# Altium schematic sheet 01-M2_NEO-M9N_MODULE.SchDoc: NOT USED
size A4; ApprovedBy: NOT USED; CheckedBy: NOT USED; Author: NOT USED; CompanyName: NOT USED; DrawnBy: NOT USED; Engineer: NOT USED; Organization: NOT USED; Address1: NOT USED; Address2: NOT USED; Address3: NOT USED; Address4: NOT USED; Revision: NOT USED; SheetNumber: 1; SheetTotal: 2; sch_PageDescription: sch_PageDescription; sch_PageTitle: sch_PageTitle; DocumentFullPathAndName: NOT USED; DocumentName: NOT USED; ImagePath: NOT USED; ProjectName: NOT USED; Application_BuildNumber: NOT USED
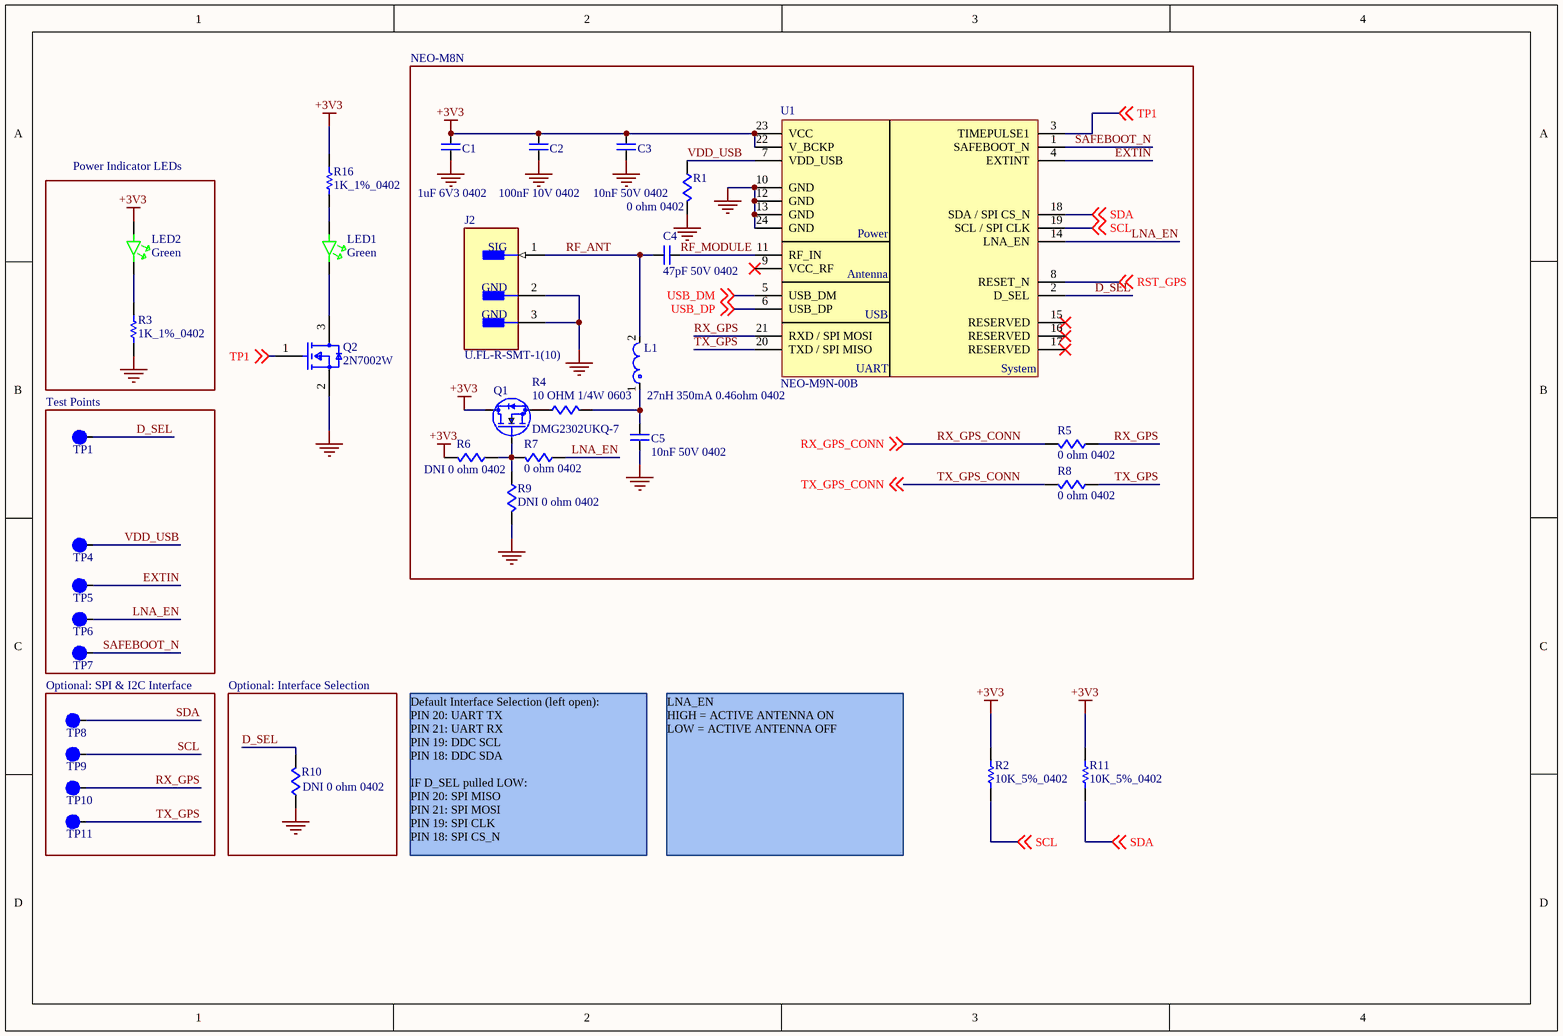
[diagram p0: 01-M2_NEO-M9N_MODULE.SchDoc]

## Parts
C1  1uF 6V3 0402  [c0402]
C2  100nF 10V 0402  [c0402]
C3  10nF 50V 0402  [c0402]
C4  47pF 50V 0402  [c0402]
C5  10nF 50V 0402  [c0402]
J2  U.FL-R-SMT-1(10)  [FP-U_FL-R-SMT-1_10-MFG]
L1  27nH 350mA 0.46ohm 0402  [FP-LQG15HH_02-IPC_C]
LED1  Green  [led0603]
LED2  Green  [led0603]
Q1  DMG2302UKQ-7  [SOT23]
Q2  2N7002W  [FP-419AB-01-IPC_C]
R1  0 ohm 0402  [r0402]
R2  10K_5%_0402  [RESC1005X40X25LL05T10]
R3  1K_1%_0402  [RESC1005X40X25NL05T05]
R4  10 OHM 1/4W 0603  [r0603]
R5  0 ohm 0402  [r0402]
R6  DNI 0 ohm 0402  [r0402]  (no BOM)
R7  0 ohm 0402  [r0402]
R8  0 ohm 0402  [r0402]
R9  DNI 0 ohm 0402  [r0402]  (no BOM)
R10  DNI 0 ohm 0402  [r0402]  (no BOM)
R11  10K_5%_0402  [RESC1005X40X25LL05T10]
R16  1K_1%_0402  [RESC1005X40X25NL05T05]
TP1  1MM  [TP1MM]  (value not drawn)  (no BOM)
TP4  1MM  [TP1MM]  (value not drawn)  (no BOM)
TP5  1MM  [TP1MM]  (value not drawn)  (no BOM)
TP6  1MM  [TP1MM]  (value not drawn)  (no BOM)
TP7  1MM  [TP1MM]  (value not drawn)  (no BOM)
TP8  1MM  [TP1MM]  (value not drawn)  (no BOM)
TP9  1MM  [TP1MM]  (value not drawn)  (no BOM)
TP10  1MM  [TP1MM]  (value not drawn)  (no BOM)
TP11  1MM  [TP1MM]  (value not drawn)  (no BOM)
U1  NEO-M9N-00B  [IC_NEO-M9N]

## Blocks framed on the sheet
NEO-M8N: C1-C5 J2 L1 Q1 R1 R4-R9 U1
Power Indicator LEDs: LED2 R3
Test Points: TP1 TP4-TP7
Optional: SPI & I2C Interface: TP8-TP11
Optional: Interface Selection: R10

## Nets
+3V3: C1.2 C2.2 C3.2 LED2.1 Q1.2(D) R2.2 R6.2 R11.2 R16.2 U1.22(V_BCKP) U1.23(VCC)
GND: C1.1 C2.1 C3.1 C5.1 J2.2(GND) J2.3(GND) Q2.2(Source) R1.2 R3.1 R9.2 R10.1 U1.10(GND) U1.12(GND) U1.13(GND) U1.24(GND)
D_SEL: R10.2 TP1.1 U1.2(D_SEL)
EXTIN: TP5.1 U1.4(EXTINT)
LNA_EN: R7.1 TP6.1 U1.14(LNA_EN)
RF_ANT: C4.1 J2.1(SIG) L1.2
RF_MODULE: C4.2 U1.11(RF_IN)
RST_GPS: U1.8(RESET_N) ; off-sheet RST_GPS
RX_GPS: R5.1 TP10.1 U1.21(RXD_/_SPI_MOSI)
RX_GPS_CONN: R5.2 ; off-sheet RX_GPS_CONN
SAFEBOOT_N: TP7.1 U1.1(SAFEBOOT_N)
SCL: R2.1 TP9.1 U1.19(SCL_/_SPI_CLK) ; off-sheet SCL
SDA: R11.1 TP8.1 U1.18(SDA_/_SPI_CS_N) ; off-sheet SDA
TP1: Q2.1(Gate) U1.3(TIMEPULSE1) ; off-sheet TP1
TX_GPS: R8.1 TP11.1 U1.20(TXD_/_SPI_MISO)
TX_GPS_CONN: R8.2 ; off-sheet TX_GPS_CONN
USB_DM: U1.5(USB_DM) ; off-sheet USB_DM
USB_DP: U1.6(USB_DP) ; off-sheet USB_DP
VDD_USB: R1.1 TP4.1 U1.7(VDD_USB)
NetC5_2: C5.2 L1.1 R4.2
NetLED1_1: LED1.1 R16.1
NetLED1_2: LED1.2 Q2.3(Drain)
NetLED2_2: LED2.2 R3.2
NetQ1_1: Q1.1(G) R6.1 R7.2 R9.1
NetQ1_3: Q1.3(S) R4.1

Not connected (* = marked no-connect by the designer): U1 9(VCC_RF)* 15(RESERVED)* 16(RESERVED)* 17(RESERVED)*

## Notes on the sheet
- Default Interface Selection (left open):
  PIN 20: UART TX
  PIN 21: UART RX
  PIN 19: DDC SCL
  PIN 18: DDC SDA
  IF D_SEL pulled LOW:
  PIN 20: SPI MISO
  PIN 21: SPI MOSI
  PIN 19: SPI CLK
  PIN 18: SPI CS_N
- LNA_EN
  HIGH = ACTIVE ANTENNA ON
  LOW = ACTIVE ANTENNA OFF
- CONFIDENTIALITY NOTICE
- TITLE
- PROJECT
- ENGINEER
- FILENAME
- GENERATED DATE
- DESCRIPTION
- SCHEMATIC NUMBER
- REV
- SHEET
- THIS DOCUMENT IS CONFIDENTIAL AND CONTAINS DESIGNS AND OTHER PROPRIETARY INFORMATION OF META PLATFORMS TECHNOLOGIES, LLC AND ITS AFFILIATES. THIS DOCUMENT AND THE INFORMATION IT CONTAINS MAY NOT BE DUPLICATED, DISCLOSED OR USED, IN WHOLE OR IN PART, FOR ANY PURPOSE (INCLUDING MANUFACTURE OF ANY COMPONENT) WITHOUT THE PRIOR WRITTEN CONSENT OF META PLATFORMS TECHNOLOGIES, LLC.
- (in symbol IC NEO-M9N-00B) Power; Antenna; USB; UART; System

## Library data of the parts
C1 = CAP CER 1UF 6.3V X7R 0402: 0402 1 uF 6.3 V ±10% Tolerance X7R Multilayer Ceramic Capacitor; Manufacturer: Murata; Manufacturer Part Number: GRM155R70J105KA12J; Voltage Rating: 6.3V; Supplier 1: Digi-Key; RoHS: Yes; Category: Ceramic Capacitors; Stock 1: 7275801; Pricing 1: 1=0.10000, 10=0.07300, 50=0.04000, 100=0.03270, 500=0.02334, 1000=0.01833, 2500=0.01666, 5000=0.01533 (USD); Mount: Surface Mount; Case/Package: 0402; Case Code (Metric): 1005; Case Code (Imperial): 0402; Weight: 0.000212oz; Min Operating Temperature: -55°C; Max Operating Temperature: 125°C; Packaging: Tape and Reel; Capacitance: 1uF; Tolerance: 10%; Dielectric: X7R; Termination: SMD/SMT; Voltage Rating (DC): 6.3V; Package Quantity: 50000; Length: 0.039inch; Width: 0.02inch; Thickness: 0.022inch; RoHS Compliant: Yes; ComponentLink1URL: http://www.mouser.com/ds/2/281/c02e-2905.pdf?src-supplier=Mouser; ComponentLink1Description: http://www.mouser.com/ds/2/281/c02e-2905.pdf?src-supplier=Mouser; ComponentLink2URL: http://search.murata.co.jp/Ceramy/image/img/A01X/G101/ENG/GRM155R70J105KA12-01.pdf?src-supplier=Digi-Key; ComponentLink2Description: http://search.murata.co.jp/Ceramy/image/img/A01X/G101/ENG/GRM155R70J105KA12-01.pdf?src-supplier=Digi-Key; Supplier Part Number 1: 490-13339-1-ND
C2 = CAP CER 0.1UF 10V X7R 0402: CL05 Series 0.1 uF 10 V ±10 % Tolerance X7R SMT Multilayer Ceramic Capacitor; Manufacturer: Samsung; Manufacturer Part Number: CL05B104KP5NNNC; Tolerance: 10%; Supplier 1: Digi-Key; RoHS: Yes; Category: Ceramic Capacitors; Stock 1: 36338332; Pricing 1: 1=0.10000, 10=0.02400, 50=0.01300, 100=0.01050, 500=0.00752, 1000=0.00592, 2500=0.00538, 5000=0.00495 (USD); Mount: Surface Mount; Case/Package: 0402; Case Code (Metric): 1005; Case Code (Imperial): 0402; Contact Plating: Tin; Min Operating Temperature: -55°C; Max Operating Temperature: 125°C; Package Quantity: 1; Packaging: Tape and Reel; Capacitance: 100nF; Voltage Rating: 10V; Dielectric: X7R; Series: CL; Construction: Flat; Length: 1mm; Width: 0.02inch; Height: 0.5mm; Thickness: 0.022inch; Depth: 0.5mm; Radiation Hardening: No; RoHS Compliant: Yes; ComponentLink1URL: https://datasheet.ciiva.com/15165/getdatasheetpartid-37100-15165107.pdf?src-supplier=Verical; ComponentLink1Description: https://datasheet.ciiva.com/15165/getdatasheetpartid-37100-15165107.pdf?src-supplier=Verical; ComponentLink2URL: https://datasheet.ciiva.com/16498/cl05b104kq5nnnc-16498491.pdf?src-supplier=Future+Electronics; ComponentLink2Description: https://datasheet.ciiva.com/16498/cl05b104kq5nnnc-16498491.pdf?src-supplier=Future+Electronics; Supplier Part Number 1: 1276-1002-1-ND
C3 C5 = CAP CER 10000PF 50V X7R 0402: Manufacturer: Murata; Manufacturer Part Number: GCM155R71H103KA55D; Tolerance: 10%; Supplier 1: Digi-Key; RoHS: Yes; Category: Ceramic Capacitors; Stock 1: 16109194; Pricing 1: 1=0.10000, 10=0.02700, 50=0.01460, 100=0.01190, 500=0.00848, 1000=0.00667, 2500=0.00606, 5000=0.00558 (USD); Mount: Surface Mount; Case/Package: 0402; Case Code (Imperial): 0402; Case Code (Metric): 1005; Min Operating Temperature: -55°C; Max Operating Temperature: 125°C; Capacitance: 10nF; Voltage Rating: 50V; Packaging: Tape and Reel; Package Quantity: 1; Dielectric: X7R; Termination: SMD/SMT; Voltage: 50V; Voltage Rating (DC): 50V; Series: GCM; Construction: Flat; Length: 1mm; Width: 0.02inch; Height: 0.5mm; Thickness: 0.022inch; Depth: 0.5mm; Ratings: AEC-Q200; Radiation Hardening: No; REACH SVHC: No SVHC; Lead Free: Lead Free; RoHS Compliant: Yes; ComponentLink1URL: https://datasheet.ciiva.com/130/product-130683.pdf?src-supplier=Digi-Key; ComponentLink1Description: https://datasheet.ciiva.com/130/product-130683.pdf?src-supplier=Digi-Key; ComponentLink2URL: https://datasheet.ciiva.com/130/product-130682.pdf?src-supplier=Digi-Key; ComponentLink2Description: https://datasheet.ciiva.com/130/product-130682.pdf?src-supplier=Digi-Key; ComponentLink3URL: https://datasheet.ciiva.com/130/product-130684.pdf?src-supplier=Digi-Key; ComponentLink3Description: https://datasheet.ciiva.com/130/product-130684.pdf?src-supplier=Digi-Key; ComponentLink4URL: https://datasheet.ciiva.com/11787/0900766b80ef92d0-11787082.pdf?src-supplier=RSComponents; ComponentLink4Description: https://datasheet.ciiva.com/11787/0900766b80ef92d0-11787082.pdf?src-supplier=RSComponents; ComponentLink5URL: https://datasheet.ciiva.com/16199/product-16199584.pdf?src-supplier=Future+Electronics; ComponentLink5Description: https://datasheet.ciiva.com/16199/product-16199584.pdf?src-supplier=Future+Electronics; ComponentLink6URL: https://datasheet.ciiva.com/18100/getdatasheetpartid-27433-18100656.pdf?src-supplier=Verical; ComponentLink6Description: https://datasheet.ciiva.com/18100/getdatasheetpartid-27433-18100656.pdf?src-supplier=Verical; ComponentLink7URL: https://datasheet.ciiva.com/2989/product-2989235.pdf?src-supplier=Avnet; ComponentLink7Description: https://datasheet.ciiva.com/2989/product-2989235.pdf?src-supplier=Avnet; Supplier Part Number 1: 490-4762-1-ND
C4 = CAP CER 47PF 50V C0G/NPO 0402: 0402 47 pF 50 V ±5 % Tolerance NP0 SMT Multilayer Ceramic Capacitor; Manufacturer: Yageo; Manufacturer Part Number: CC0402JRNPO9BN470; Tolerance: 5%; Dielectric: C0G; Insulation Resistance: 100GR; Supplier 1: Digi-Key; RoHS: Yes; Category: Ceramic Capacitors; Stock 1: 4278982; Pricing 1: 1=0.10000, 10=0.01800, 50=0.01000, 100=0.00820, 500=0.00584, 1000=0.00458, 2500=0.00417, 5000=0.00383 (USD); Mount: Surface Mount; Case/Package: 0402; Number of Pins: 2; Case Code (Metric): 1005; Case Code (Imperial): 0402; Weight: 2.3E-05oz; Dielectric Material: Ceramic; Min Operating Temperature: -55°C; Max Operating Temperature: 125°C; Capacitance: 47pF; Voltage Rating: 50V; Package Quantity: 1; Packaging: Tape and Reel; Voltage Rating (DC): 50V; Termination: SMD/SMT; Resistor Type: Ceramic; Voltage: 50V; Series: CC; Length: 1mm; Width: 0.02inch; Height: 0.5mm; Thickness: 0.022inch; Depth: 0.5mm; Radiation Hardening: No; REACH SVHC: No SVHC; Lead Free: Lead Free; RoHS Compliant: Yes; ComponentLink1URL: https://datasheet.ciiva.com/28450/1443161-28450267.pdf?src-supplier=Element14; ComponentLink1Description: https://datasheet.ciiva.com/28450/1443161-28450267.pdf?src-supplier=Element14; ComponentLink2URL: https://datasheet.ciiva.com/8033/1443161-8033638.pdf?src-supplier=Element14; ComponentLink2Description: https://datasheet.ciiva.com/8033/1443161-8033638.pdf?src-supplier=Element14; ComponentLink3URL: https://datasheet.ciiva.com/8033/1443161-8033637.pdf?src-supplier=Element14; ComponentLink3Description: https://datasheet.ciiva.com/8033/1443161-8033637.pdf?src-supplier=Element14; ComponentLink4URL: https://datasheet.ciiva.com/161/mlccorderingcode-161493.pdf?src-supplier=Digi-Key; ComponentLink4Description: https://datasheet.ciiva.com/161/mlccorderingcode-161493.pdf?src-supplier=Digi-Key; ComponentLink5URL: https://datasheet.ciiva.com/161/mlccorderingcode-161492.pdf?src-supplier=Digi-Key; ComponentLink5Description: https://datasheet.ciiva.com/161/mlccorderingcode-161492.pdf?src-supplier=Digi-Key; ComponentLink6URL: https://datasheet.ciiva.com/161/mlccorderingcode-161494.pdf?src-supplier=Digi-Key; ComponentLink6Description: https://datasheet.ciiva.com/161/mlccorderingcode-161494.pdf?src-supplier=Digi-Key; Supplier Part Number 1: 311-1021-1-ND
J2 = CMP-2000-05152-3: CONN U.FL RCPT STR 50 OHM SMD; Max Frequency: 6GHz; Connector Type: Coaxial; Body Plating: Silver; Body Material: Bronze; Impedance: 50R; Dielectric Material: Polymer; Insulation Resistance: 500MR; Gender: Male; Packaging: Cut Tape; Length: 3mm; Package Quantity: 2500; Termination: Solder; Lead Free: Lead Free; Series: U.FL; Min Operating Temperature: -40°C; Fastening Type: Snap; Contact Material: Brass; Orientation: Straight; Wire/Cable Type: Coaxial; Frequency: 6GHz; Contact Plating: Gold; Depth: 3.1mm; Weight: 0.001764oz; Max Operating Temperature: 90°C; Radiation Hardening: No; REACH SVHC: No SVHC; Mount: Surface Mount; Housing Color: Beige
L1 = CMP-2000-06578-2: Multilayer type RF Inductor 27nH ±5% 0.46Ω 350mA 0402; Manufacturer Part Number: LQG15HS27NJ02D; DC Current: 300mA; Core Material: Air; Self Resonant Frequency: 1.7GHz; Q Factor: 8; DC Resistance (DCR): 460mR; Shielding: Unshielded; Test Frequency: 100MHz; Inductance: 27nH; Width: 0.02inch; Length: 1mm; Height - Seated (Max): 0.022inch; Military Standard: Not; Case Code (Imperial): 0402; Tolerance: 5%; Depth: 0.55mm; Current Rating: 300mA; Inductance Tolerance: 5%; Lead Free: Lead Free; Height: 0.5mm; Max DC Current: 300mA; REACH SVHC: No SVHC; Package Quantity: 10000; Mount: Surface Mount; Termination: SMD/SMT; Case Code (Metric): 1005; Case/Package: 0402; Max Operating Temperature: 125°C; Packaging: Tape and Reel; Min Operating Temperature: -55°C
LED1 LED2 = LED GREEN CLEAR CHIP SMD: LED High-Power Uni-Color Green 574nm 2-Pin Chip LED T/R; Manufacturer: Vishay Lite-On; Manufacturer Part Number: LTST-C190KGKT; Lens Color: Colorless; Lens Style: Diffused,Colorless,Rectangular,Clear; Forward Voltage: 2V; Forward Current: 30mA; Luminous Intensity: 35mcd; Viewing Angle: 130°; Power Rating: 75mW; Dominant Wavelength: 571nm; Test Current: 20mA; Lens Transparency: Clear; Number of Elements: 1; Reverse Voltage: 5V; Supplier 1: Digi-Key; RoHS: Yes; Category: LEDs; Stock 1: 1803324; Pricing 1: 1=0.24000, 10=0.13200, 100=0.06110, 500=0.05640, 1000=0.04418, 2000=0.04324 (USD); Mount: Surface Mount; Case/Package: 0603; Number of Pins: 2; Color: Green; Case Code (Metric): 1608; Case Code (Imperial): 0603; Min Operating Temperature: -55°C; Max Operating Temperature: 85°C; Package Quantity: 1; Packaging: Tape and Reel; Illumination Color: Green; Power Dissipation: 75mW; Wavelength: 574nm; Number of LEDs: 1; Length: 1.6mm; Width: 0.8mm; Height: 0.8mm; Depth: 0.8mm; Radiation Hardening: No; Lead Free: Lead Free; RoHS Compliant: Yes; ComponentLink1URL: https://datasheet.ciiva.com/11774/0900766b80dc02a8-11774060.pdf?src-supplier=RSComponents; ComponentLink1Description: https://datasheet.ciiva.com/11774/0900766b80dc02a8-11774060.pdf?src-supplier=RSComponents; ComponentLink2URL: https://datasheet.ciiva.com/12403/100-ltst-c190kgkt-63268-12403899.pdf?src-supplier=Mouser; ComponentLink2Description: https://datasheet.ciiva.com/12403/100-ltst-c190kgkt-63268-12403899.pdf?src-supplier=Mouser; ComponentLink3URL: https://datasheet.ciiva.com/15117/getdatasheetpartid-141494-15117731.pdf?src-supplier=Verical; ComponentLink3Description: https://datasheet.ciiva.com/15117/getdatasheetpartid-141494-15117731.pdf?src-supplier=Verical; ComponentLink4URL: https://datasheet.ciiva.com/2109/s-110-ltst-c190kgkt-2109989.pdf?src-supplier=Digi-Key; ComponentLink4Description: https://datasheet.ciiva.com/2109/s-110-ltst-c190kgkt-2109989.pdf?src-supplier=Digi-Key; ComponentLink5URL: https://datasheet.ciiva.com/2109/s-110-ltst-c190kgkt-2109988.pdf?src-supplier=Digi-Key; ComponentLink5Description: https://datasheet.ciiva.com/2109/s-110-ltst-c190kgkt-2109988.pdf?src-supplier=Digi-Key; ComponentLink6URL: https://datasheet.ciiva.com/2109/s-110-ltst-c190kgkt-2109990.pdf?src-supplier=Digi-Key; ComponentLink6Description: https://datasheet.ciiva.com/2109/s-110-ltst-c190kgkt-2109990.pdf?src-supplier=Digi-Key; Supplier Part Number 1: 160-1435-1-ND
Q1 = DMG2302UKQ-7: N-Channel 20 V 2.8A (Ta) 660mW (Ta) Surface Mount SOT-23-3; Mfr_Name: Diodes Inc; Manufacturer: Diodes; Type: DEV; Drain to Source Voltage (Vdss): 20V; Rds On Max: 90mR; Input Capacitance: 130pF; Copyright: Copyright (C) 2022 Ultra Librarian. All rights reserved.; Manufacturer_Part_Number: DMG2302UKQ-7; Digi-Key_Part_Number_1: 31-DMG2302UKQ-7TR-ND; Digi-Key_Part_Number_2: 31-DMG2302UKQ-7CT-ND; Digi-Key_Part_Number_3: 31-DMG2302UKQ-7DKR-ND; RefDes: RefDes; Supplier 1: Digi-Key; Manufacturer Part Number: DMG2302UKQ-7; RoHS: Yes; Stock 1: 997695; Pricing 1: 1=0.48000, 10=0.36000, 100=0.22400, 500=0.15330, 1000=0.11792 (USD); Mount: Surface Mount; Case/Package: SOT-23; Min Operating Temperature: -55°C; Max Operating Temperature: 150°C; Packaging: Tape and Reel; Continuous Drain Current (ID): 2.8A; Max Power Dissipation: 660mW; Supplier Part Number 1: 31-DMG2302UKQ-7CT-ND
Q2 = CMP-07173-000098-1: MOSFET N-CH 60V 115MA SOT-323; Turn-On Delay Time: 5.85ns; Number of Elements: 1; Max Power Dissipation: 200mW; On-State Resistance: 7.5R; Element Configuration: Single; Gate to Source Voltage (Vgs): 20V; Input Capacitance: 50pF; Threshold Voltage: 1.76V; Turn-Off Delay Time: 12.5ns; Height: 1mm; Contact Plating: Tin; Package Quantity: 1; Continuous Drain Current (ID): 115mA; Case/Package: SOT-323; Lead Free: Lead Free; REACH SVHC: No SVHC; Packaging: Tape and Reel; Min Operating Temperature: -55°C; Weight: 0.03g; Drain to Source Voltage (Vdss): 60V; Width: 1.25mm; Mount: Surface Mount; Rds On Max: 7.5R; Drain to Source Resistance: 7.5R; Max Operating Temperature: 150°C; Radiation Hardening: No; Number of Pins: 3; Power Dissipation: 200mW; Drain to Source Breakdown Voltage: 60V; Length: 2mm
R1 R5-R10 = RES 0 OHM JUMPER 1/16W 0402: RES SMD 0 OHM JUMPER 1/16W 0402; Manufacturer: Yageo; Manufacturer Part Number: RC0402JR-070RL; Resistance: 0mR; Power Rating: 62.5mW; Tolerance: 5%; Voltage Rating: 50V; Max Power Dissipation: 63mW; Temperature Coefficient: 200ppm/°C; Supplier 1: Digi-Key; RoHS: Yes; Category: Chip SMD Resistors; Stock 1: 45165868; Pricing 1: 1=0.10000, 10=0.01200, 25=0.00840, 50=0.00640, 100=0.00480, 250=0.00364, 500=0.00290, 1000=0.00214, 5000=0.00154 (USD); Case/Package: 0402; Case Code (Metric): 1005; Case Code (Imperial): 0402; Contact Plating: Tin,Matte; Size Code: 0402; Min Operating Temperature: -55°C; Max Operating Temperature: 155°C; Package Quantity: 1; Packaging: Tape and Reel; Resistor Type: Thick Film; Number of Terminations: 2; Termination: SMD/SMT; Features: Moisture Resistant; Series: RC; Technology: THICK FILM; Resistance Tolerance: 5%; Construction: Rectangular; Length: 1mm; Width: 0.02inch; Height: 0.016inch; Depth: 0.5mm; Radiation Hardening: No; REACH SVHC: Unknown; Military Standard: Not; Lead Free: Lead Free; RoHS Compliant: Yes; ComponentLink1URL: https://datasheet.ciiva.com/2452/pyu-rc0402-51-rohs-l-6-2452608.pdf?src-supplier=Digi-Key; ComponentLink1Description: https://datasheet.ciiva.com/2452/pyu-rc0402-51-rohs-l-6-2452608.pdf?src-supplier=Digi-Key; ComponentLink2URL: https://datasheet.ciiva.com/11808/0900766b80c66297-11808195.pdf?src-supplier=RSComponents; ComponentLink2Description: https://datasheet.ciiva.com/11808/0900766b80c66297-11808195.pdf?src-supplier=RSComponents; ComponentLink3URL: https://datasheet.ciiva.com/7983/1018594-7983535.pdf?src-supplier=Element14; ComponentLink3Description: https://datasheet.ciiva.com/7983/1018594-7983535.pdf?src-supplier=Element14; ComponentLink4URL: https://datasheet.ciiva.com/22747/1018594-22747515.pdf?src-supplier=Element14; ComponentLink4Description: https://datasheet.ciiva.com/22747/1018594-22747515.pdf?src-supplier=Element14; ComponentLink5URL: https://datasheet.ciiva.com/2452/pyu-r-int-thick-7-2452609.pdf?src-supplier=Digi-Key; ComponentLink5Description: https://datasheet.ciiva.com/2452/pyu-r-int-thick-7-2452609.pdf?src-supplier=Digi-Key; ComponentLink6URL: https://datasheet.ciiva.com/2452/pyu-r-int-thick-7-2452610.pdf?src-supplier=Digi-Key; ComponentLink6Description: https://datasheet.ciiva.com/2452/pyu-r-int-thick-7-2452610.pdf?src-supplier=Digi-Key; ComponentLink7URL: https://datasheet.ciiva.com/8896/pyu-rc0402-51-rohs-l-6-8896201.pdf?src-supplier=Avnet; ComponentLink7Description: https://datasheet.ciiva.com/8896/pyu-rc0402-51-rohs-l-6-8896201.pdf?src-supplier=Avnet; ComponentLink8URL: https://datasheet.ciiva.com/15189/getdatasheetpartid-326379-15189533.pdf?src-supplier=Verical; ComponentLink8Description: https://datasheet.ciiva.com/15189/getdatasheetpartid-326379-15189533.pdf?src-supplier=Verical; Supplier Part Number 1: 311-0.0JRCT-ND
R2 R11 = CMP-2002-07353-1: Part Number: RC0402FR-0710KL; Manufacturer: Yageo / Phycomp
R3 R16 = CMP-1011-00510-4: Chip Resistor, 1 KOhm, +/- 1%, 100 mW, -55 to 155 degC, 0402 (1005 Metric), RoHS, Tape and Reel; PartNumber: ERJ-2RKF1001X; Manufacturer: Basic Passives; Voltage Rating: 50 V; Case\/Package: 0402; Resistance: 1 KOhm; Power Rating: 100 mW; DatasheetVersion: 04/2015; Radiation Hardening: No; Pins: 2; Height: 0.35 mm; RoHSCompliant: true; Case Code (Imperial): 0402; ComponentLink2Description: Datasheet; ComponentLink1Description: Manufacturer URL; PackageReference: 0402; Mount: Surface Mount; Package Quantity: 10000; Tolerance: 1%; ComponentLink1URL: http://www.panasonic.com/; PackageDescription: 2-Pin Surface Mount Device, Body 1 x 0.5 mm; Mounting Technology: Surface Mount; Case Code (Metric): 1005; ComponentLink2URL: http://industrial.panasonic.com/cdbs/www-data/pdf/RDA0000/AOA0000C86.pdf; REACH SVHC: Yes; Packaging: Tape and Reel; Max Operating Temperature: 155 degC; Min Operating Temperature: -55 degC; Width: 0.5 mm; Length: 1 mm
R4 = RES SMD 10 OHM 1% 1/4W 0603: Res Surge Chip Thick Film 0603 10 Ohm 1% 1/4W ±200ppm/°C Molded Paper T/R; Manufacturer: Yageo; Manufacturer Part Number: SR0603FR-7T10RL; Supplier 1: Digi-Key; RoHS: Yes; Category: Chip SMD Resistors; Stock 1: 13323; Pricing 1: 1=0.75000, 10=0.55100, 100=0.32080, 1000=0.17992, 2500=0.17370 (USD); RoHS Compliant: Yes; ComponentLink1URL: http://www.yageo.com/documents/recent/PYu-SR_D_F%20tol_RoHS_L_3.pdf?src-supplier=Digi-Key; ComponentLink1Description: http://www.yageo.com/documents/recent/PYu-SR_D_F%20tol_RoHS_L_3.pdf?src-supplier=Digi-Key; Supplier Part Number 1: YAG5824CT-ND
TP1 TP4-TP11 = TP_1MM: Test Point 1MM diameter
U1 = IC NEO-M9N-00B: GNSS module, Flash, TCXO, SAW, LNA, LCC, 12x16 mm Professional Grade; Manufacturer: u-blox; Supplier 1: Digi-Key; Manufacturer Part Number: NEO-M9N-00B; RoHS: Yes; Category: RF Receivers, Transceivers; Stock 1: 250; Pricing 1: 1=27.00000, 10=23.92000, 50=19.61000, 100=15.68010 (USD); RoHS Compliant: Yes; Supplier Part Number 1: 672-NEO-M9N-00BCT-ND